# Altium schematic sheet Sheet1.SchDoc: 55
size A3; Date: 2022/5/23; Author: Ashkan Younesi; CompanyName: Electroboard.ir; DrawnBy: Ashkan Younesi; Engineer: Ashkan Younesi; DocumentNumber: 1; Revision: 1; SheetNumber: 1; SheetTotal: 1; Time: Sim808-with-ESP32
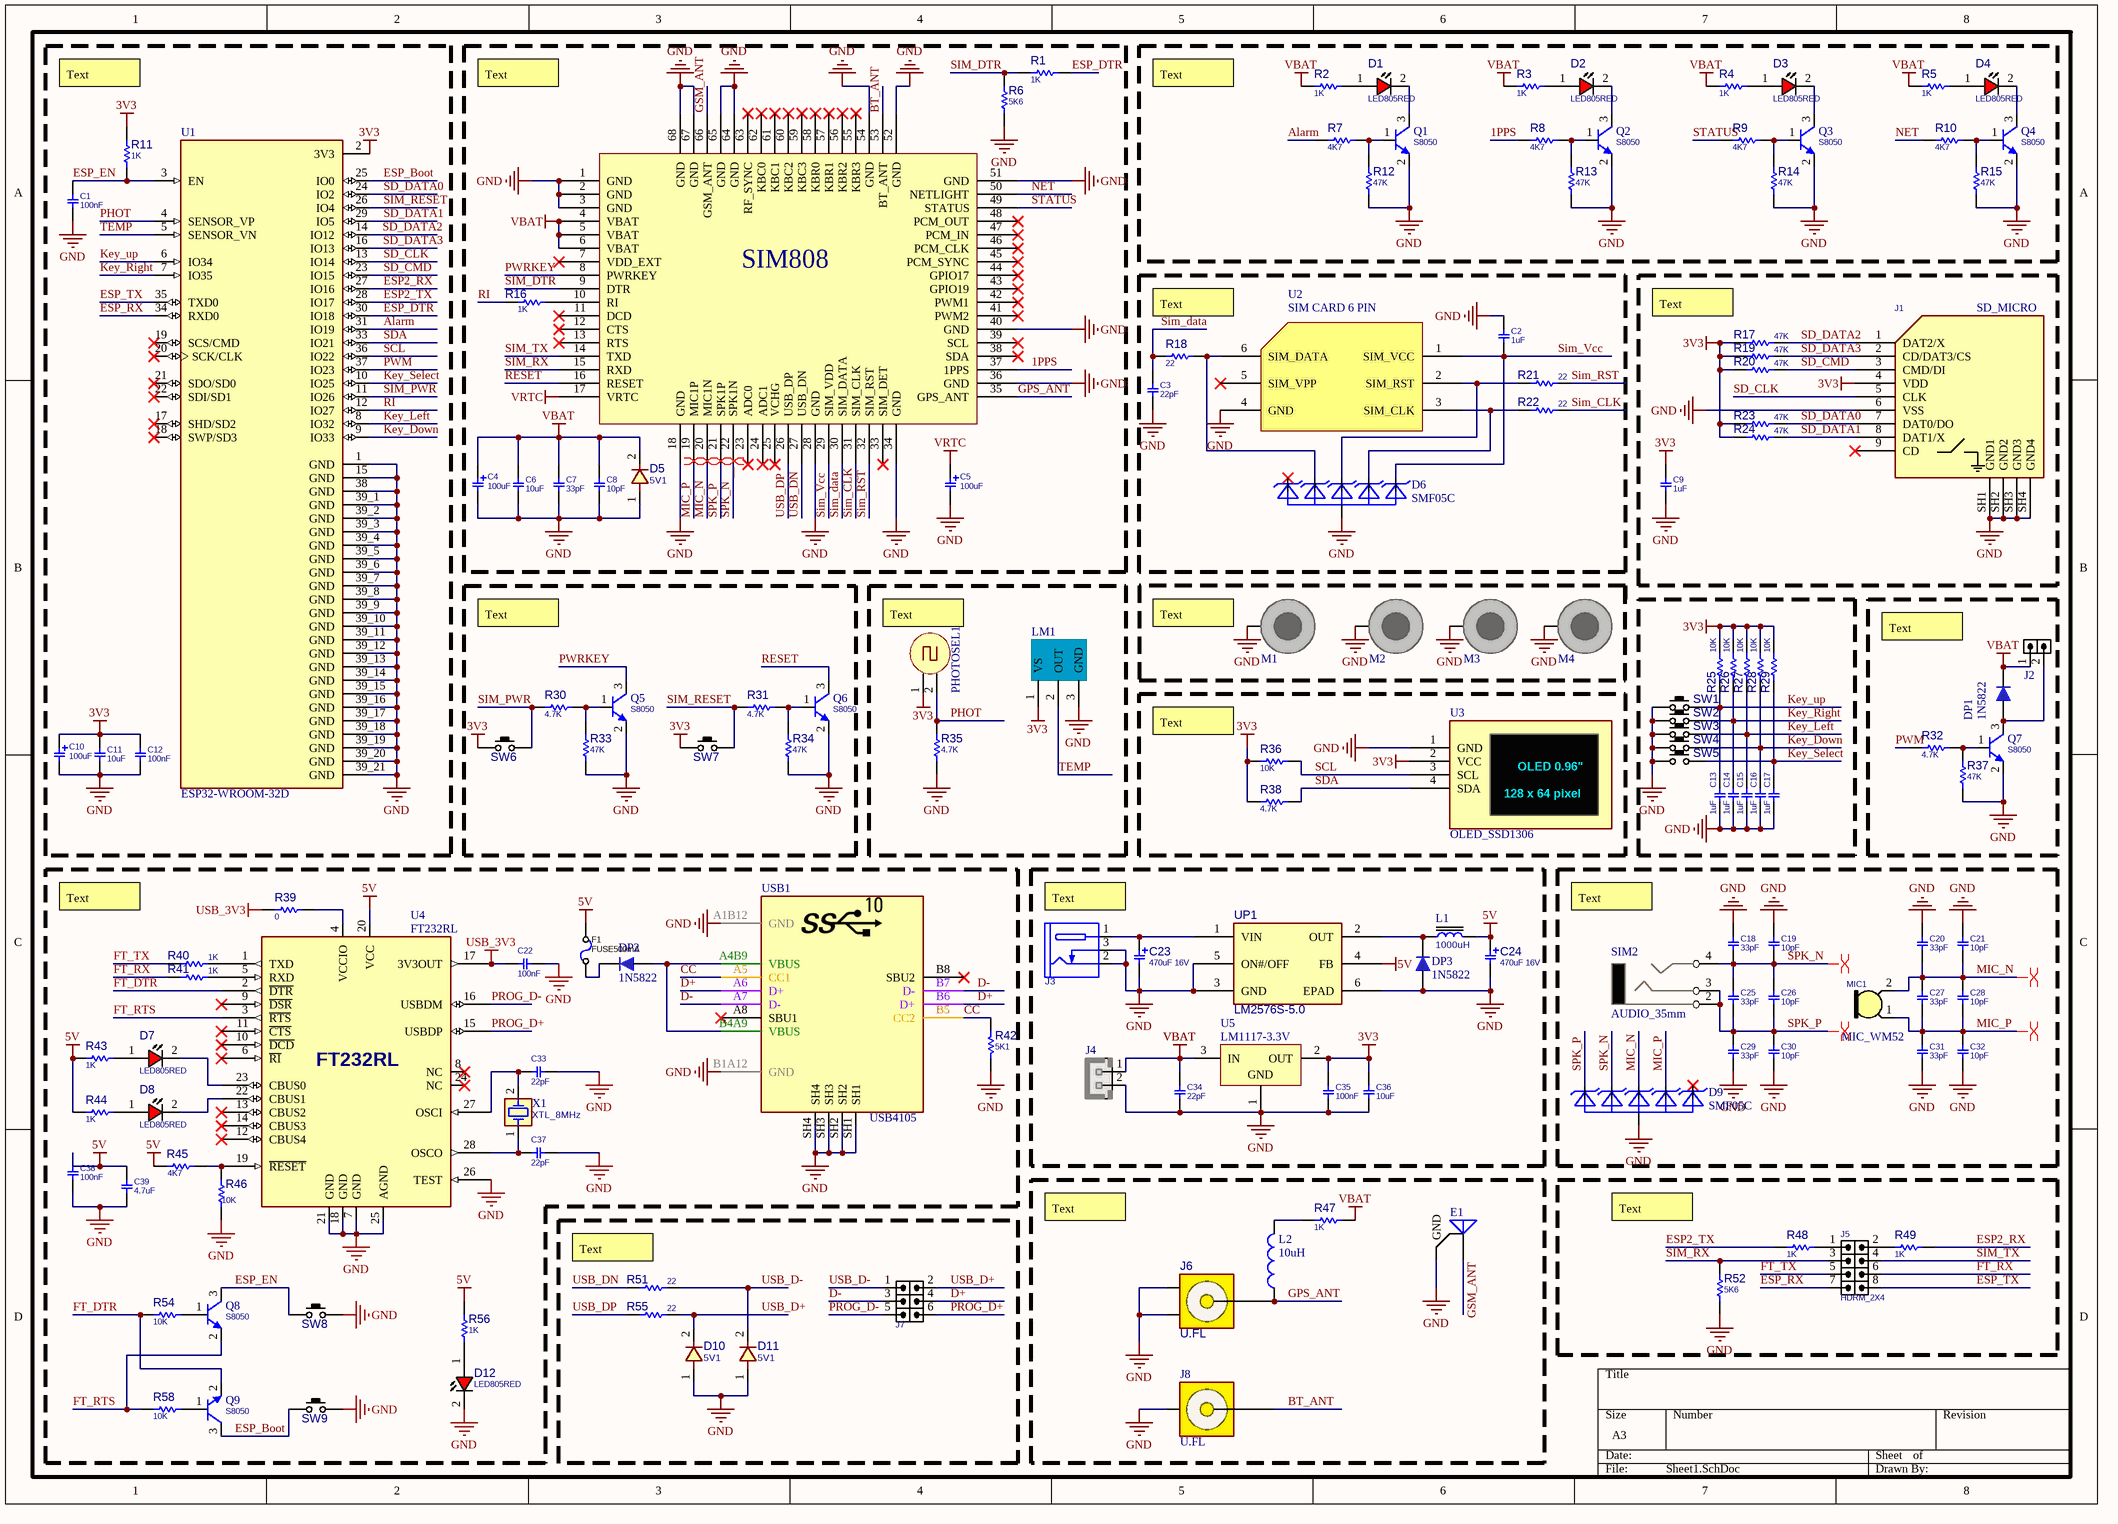
[diagram p0: Sheet1.SchDoc]

## Parts
C1  100nF  [C0805]
C2  1uF  [C0805]
C3  22pF  [C0805]
C4  100uF  [C_TN_3528]
C5  100uF  [C_TN_3528]
C6  10uF  [C0805]
C7  33pF  [C0805]
C8  10pF  [C0805]
C9  1uF  [C0805]
C10  100uF  [C_TN_3528]
C11  10uF  [C0805]
C12  100nF  [C0805]
C13  1uF  [C0805]
C14  1uF  [C0805]
C15  1uF  [C0805]
C16  1uF  [C0805]
C17  1uF  [C0805]
C18  33pF  [C0805]
C19  10pF  [C0805]
C20  33pF  [C0805]
C21  10pF  [C0805]
C22  100nF  [C0805]
C23  470uF 16V  [C_EL_8]
C24  470uF 16V  [C_EL_8]
C25  33pF  [C0805]
C26  10pF  [C0805]
C27  33pF  [C0805]
C28  10pF  [C0805]
C29  33pF  [C0805]
C30  10pF  [C0805]
C31  33pF  [C0805]
C32  10pF  [C0805]
C33  22pF  [C0805]
C34  22pF  [C0805]
C35  100nF  [C0805]
C36  10uF  [C0805]
C37  22pF  [C0805]
C38  100nF  [C0805]
C39  4.7uF  [C0805]
D1  LED805RED  [LED0805RED]
D2  LED805RED  [LED0805RED]
D3  LED805RED  [LED0805RED]
D4  LED805RED  [LED0805RED]
D5  5V1  [D_SOD80]
D6  SMF05C  [SMF05C]
D7  LED805RED  [LED0805RED]
D8  LED805RED  [LED0805RED]
D9  SMF05C  [SMF05C]
D10  5V1  [D_SOD80]
D11  5V1  [D_SOD80]
D12  LED805RED  [LED0805RED]
DP1  1N5822  [430X270D]
DP2  1N5822  [430X270D]
DP3  1N5822  [430X270D]
E1  Antenna  [SMA_Right]  (value not drawn)
F1  FUSE500mA  [F0805]
J1  SD_MICRO  [SDMICRO_AT]
J2  HDRM2  [HDR_M_1X2]  (value not drawn)
J3  DC_POWER_JACK  [JAC_PWR2]  (value not drawn)
J4  HHDR_2  [XH_2]  (value not drawn)
J5  HDRM_2X4  [HDR_M_2X4]
J6  U.FL  [UFL]
J7  HDRM_2X3  [HDR_M_2X3]  (value not drawn)
J8  U.FL  [2.4Ghz]
L1  1000uH  [L_12]
L2  10uH  [IND1206]
LM1  LM35  [TO-92B]  (value not drawn)
M1  DNP/MH  [SCMH_M3]  (value not drawn)  (no BOM)
M2  DNP/MH  [SCMH_M3]  (value not drawn)  (no BOM)
M3  DNP/MH  [SCMH_M3]  (value not drawn)  (no BOM)
M4  DNP/MH  [SCMH_M3]  (value not drawn)  (no BOM)
MIC1  MIC_WM52  [MIC_C9]
PHOTOSEL1  PHOTOSEL  [PHOTOSEL_3mm]  (value not drawn)
Q1  S8050  [SOT23_3]
Q2  S8050  [SOT23_3]
Q3  S8050  [SOT23_3]
Q4  S8050  [SOT23_3]
Q5  S8050  [SOT23_3]
Q6  S8050  [SOT23_3]
Q7  S8050  [SOT23_3]
Q8  S8050  [SOT23_3]
Q9  S8050  [SOT23_3]
R1  1K  [R0805]
R2  1K  [R0805]
R3  1K  [R0805]
R4  1K  [R0805]
R5  1K  [R0805]
R6  5K6  [R0805]
R7  4K7  [R0805]
R8  4K7  [R0805]
R9  4K7  [R0805]
R10  4K7  [R0805]
R11  1K  [R0805]
R12  47K  [R0805]
R13  47K  [R0805]
R14  47K  [R0805]
R15  47K  [R0805]
R16  1K  [R0805]
R17  47K  [R0805]
R18  22  [R0805]
R19  47K  [R0805]
R20  47K  [R0805]
R21  22  [R0805]
R22  22  [R0805]
R23  47K  [R0805]
R24  47K  [R0805]
R25  10K  [R0805]
R26  10K  [R0805]
R27  10K  [R0805]
R28  10K  [R0805]
R29  10K  [R0805]
R30  4.7K  [R0805]
R31  4.7K  [R0805]
R32  4.7K  [R0805]
R33  47K  [R0805]
R34  47K  [R0805]
R35  4.7K  [R0805]
R36  10K  [R0805]
R37  47K  [R0805]
R38  4.7K  [R0805]
R39  0  [R0805]
R40  1K  [R0805]
R41  1K  [R0805]
R42  5K1  [R0805]
R43  1K  [R0805]
R44  1K  [R0805]
R45  4K7  [R0805]
R46  10K  [R0805]
R47  1K  [R0805]
R48  1K  [R0805]
R49  1K  [R0805]
R51  22  [R0805]
R52  5K6  [R0805]
R54  10K  [R0805]
R55  22  [R0805]
R56  1K  [R0805]
R58  10K  [R0805]
SIM1  sim808  [sim808_fp]  (value not drawn)
SIM2  AUDIO_35mm  [AUDIO_JACK2]
SW1  PUSHBUTTON  [SWPBS_SPST_6X3X5]  (value not drawn)
SW2  PUSHBUTTON  [SWPBS_SPST_6X3X5]  (value not drawn)
SW3  PUSHBUTTON  [SWPBS_SPST_6X3X5]  (value not drawn)
SW4  PUSHBUTTON  [SWPBS_SPST_6X3X5]  (value not drawn)
SW5  PUSHBUTTON  [SWPBS_SPST_6X3X5]  (value not drawn)
SW6  PUSHBUTTON  [SWPBS_SPST_6X3X5]  (value not drawn)
SW7  PUSHBUTTON  [SWPBS_SPST_6X3X5]  (value not drawn)
SW8  PUSHBUTTON  [SWPBS_SPST_6X3X5]  (value not drawn)
SW9  PUSHBUTTON  [SWPBS_SPST_6X3X5]  (value not drawn)
U1  ESP32-WROOM-32D  [MODULE_ESP32-WROOM-32D]
U2  SIM CARD 6 PIN  [SIM CARD 6 PIN nano]
U3  OLED_SSD1306  [OLED_SSD1306_64_I2C]
U4  FT232RL  [SOG65_28_W]
U5  LM1117-3.3V  [LM1117_SMD_SOT-223_3.3V]
UP1  LM2576S-5.0  [D2PAK_5]
USB1  USB4105  [USBC_SMD_16_USB4105]
X1  XTL_8MHz  [XTL_2_11X5]

## Nets
3V3: C9.1 C10.1 C11.1 C12.1 C35.2 C36.2 J1.4(VDD) LM1.1(VS) PHOTOSEL1.1 R11.1 R17.2 R19.2 R20.2 R23.2 R24.2 R25.2 R26.2 R27.2 R28.2 R29.2 R36.1 R38.2 SW6.1(P1) SW7.1(P1) U1.2(3V3) U3.2(VCC) U5.2(OUT)
5V: C24.1 C38.2 C39.2 F1.1 L1.2 R43.1 R44.1 R45.2 R56.1 U4.20(VCC) UP1.4(FB)
GND: C1.2 C2.1 C3.1 C4.2 C5.2 C6.1 C7.1 C8.1 C9.2 C10.2 C11.2 C12.2 C13.1 C14.1 C15.1 C16.1 C17.1 C18.2 C19.1 C20.2 C21.2 C22.2 C23.2 C24.2 C29.1 C30.1 C31.1 C32.1 C33.2 C34.1 C35.1 C36.1 C37.2 C38.1 C39.1 D5.1 D6.2(A) D9.2(A) D10.1 D11.1 D12.2(CATHODE) DP3.1 E1.2(GND) J1.6(VSS) J1.SH1(GND1) J1.SH2(GND2) J1.SH3(GND3) J1.SH4(GND4) J3.2(SLEEVE) J3.3(INSERTION_DET) J4.2 J6.2(G1) J6.3(G2) J8.2(G1) LM1.3(GND) M1.1 M2.1 M3.1 M4.1 Q1.2(E) Q2.2(E) Q3.2(E) Q4.2(E) Q5.2(E) Q6.2(E) Q7.2(E) R6.1 R12.1 R13.1 R14.1 R15.1 R33.1 R34.1 R35.1 R37.1 R42.1 R46.1 R52.1 SIM1.1(GND) SIM1.2(GND) SIM1.3(GND) SIM1.18(GND) SIM1.28(GND) SIM1.34(GND) SIM1.36(GND) SIM1.40(GND) SIM1.51(GND) SIM1.52(GND) SIM1.54(GND) SIM1.64(GND) SIM1.65(GND) SIM1.67(GND) SIM1.68(GND) SW1.1(P1) SW2.1(P1) SW3.1(P1) SW4.1(P1) SW5.1(P1) SW8.2(P3) SW9.2(P3) U1.1(GND) U1.15(GND) U1.38(GND) U1.39_1(GND) U1.39_2(GND) U1.39_3(GND) U1.39_4(GND) U1.39_5(GND) U1.39_6(GND) U1.39_7(GND) U1.39_8(GND) U1.39_9(GND) U1.39_10(GND) U1.39_11(GND) U1.39_12(GND) U1.39_13(GND) U1.39_14(GND) U1.39_15(GND) U1.39_16(GND) U1.39_17(GND) U1.39_18(GND) U1.39_19(GND) U1.39_20(GND) U1.39_21(GND) U2.4(GND) U3.1(GND) U4.7(GND) U4.18(GND) U4.21(GND) U4.25(AGND) U4.26(TEST) U5.1(GND) UP1.3(GND) UP1.5(ON#/OFF) UP1.6(EPAD) USB1.A1B12(GND) USB1.B1A12(GND) USB1.SH1 USB1.SH2 USB1.SH3 USB1.SH4
USB_3V3: C22.1 R39.1 U4.17(3V3OUT)
VBAT: C4.1 C6.2 C7.2 C8.2 C34.2 D5.2 DP1.2 J2.1 J4.1 R2.2 R3.2 R4.2 R5.2 R47.1 SIM1.4(VBAT) SIM1.5(VBAT) SIM1.6(VBAT) U5.3(IN)
VRTC: C5.1 SIM1.17(VRTC)
1PPS: R8.1 SIM1.37(1PPS)
~{SIM_RX}: J5.3 R52.2 SIM1.15(RXD)
Alarm: R7.1 U1.31(IO19)
BT_ANT: J8.1(SIG) SIM1.53(BT_ANT)
CC: R42.2 USB1.A5(CC1) USB1.B5(CC2)
D+: J7.4 USB1.A6(D+) USB1.B6(D+)
D-: J7.3 USB1.A7(D-) USB1.B7(D-)
ESP2_RX: R49.1 U1.27(IO16)
ESP2_TX: R48.2 U1.28(IO17)
ESP_Boot: Q9.3(C) SW9.1(P1) U1.25(IO0)
ESP_DTR: R1.1 U1.30(IO18)
ESP_EN: C1.1 Q8.3(C) R11.2 SW8.1(P1) U1.3(EN)
ESP_RX: J5.7 U1.34(RXD0)
ESP_TX: J5.8 U1.35(TXD0)
FT_DTR: Q9.2(E) R54.1 U4.2(~{DTR})
FT_RTS: Q8.2(E) R58.1 U4.3(~{RTS})
FT_RX: J5.6 R41.1
FT_TX: J5.5 R40.1
GPS_ANT: J6.1(SIG) L2.1 SIM1.35(GPS_ANT)
GSM_ANT: E1.1(A) SIM1.66(GSM_ANT)
Key_Down: C16.2 R28.1 SW4.2(P3) U1.9(IO33)
Key_Left: C15.2 R27.1 SW3.2(P3) U1.8(IO32)
Key_Right: C14.2 R26.1 SW2.2(P3) U1.7(IO35)
Key_Select: C17.2 R29.1 SW5.2(P3) U1.10(IO25)
Key_up: C13.2 R25.1 SW1.2(P3) U1.6(IO34)
MIC_N: C20.1 C21.1 C27.2 C28.2 D9.4(C3) MIC1.2(GND) SIM1.20(MIC1N)
MIC_P: C27.1 C28.1 C31.2 C32.2 D9.5(C4) MIC1.1(OUT) SIM1.19(MIC1P)
NET: R10.1 SIM1.50(NETLIGHT)
PHOT: PHOTOSEL1.2 R35.2 U1.4(SENSOR_VP)
PROG_D+: J7.6 U4.15(USBDP)
PROG_D-: J7.5 U4.16(USBDM)
PWM: R32.1 U1.37(IO23)
PWRKEY: Q5.3(C) SIM1.8(PWRKEY)
RESET: Q6.3(C) SIM1.16(RESET)
RI: R16.2 U1.12(IO27)
SCL: R36.2 U1.36(IO22) U3.3(SCL)
SD_CLK: J1.5(CLK) U1.13(IO14)
SD_CMD: J1.3(CMD/DI) R20.1 U1.23(IO15)
SD_DATA0: J1.7(DAT0/DO) R23.1 U1.24(IO2)
SD_DATA1: J1.8(DAT1/X) R24.1 U1.29(IO5)
SD_DATA2: J1.1(DAT2/X) R17.1 U1.14(IO12)
SD_DATA3: J1.2(CD/DAT3/CS) R19.1 U1.16(IO13)
SDA: R38.1 U1.33(IO21) U3.4(SDA)
Sim_CLK: R22.1 SIM1.31(SIM_CLK)
Sim_data: C3.2 R18.2 SIM1.30(SIM_DATA)
SIM_DTR: R1.2 R6.2 SIM1.9(DTR)
SIM_PWR: R30.1 SW6.2(P3) U1.11(IO26)
SIM_RESET: R31.1 SW7.2(P3) U1.26(IO4)
Sim_RST: R21.1 SIM1.32(SIM_RST)
SIM_TX: J5.4 SIM1.14(TXD)
Sim_Vcc: C2.2 D6.6(C5) SIM1.29(SIM_VDD) U2.1(SIM_VCC)
SPK_N: C18.1 C19.2 C25.2 C26.2 D9.3(C2) SIM1.22(SPK1N) SIM2.4
SPK_P: C25.1 C26.1 C29.2 C30.2 D9.1(C1) SIM1.21(SPK1P) SIM2.2 SIM2.3
STATUS: R9.1 SIM1.49(STATUS)
TEMP: LM1.2(OUT) U1.5(SENSOR_VN)
USB_D+: D10.2 J7.2 R55.1
USB_D-: D11.2 J7.1 R51.1
USB_DN: R51.2 SIM1.27(USB_DN)
USB_DP: R55.2 SIM1.26(USB_DP)
NetC23_1: C23.1 J3.1(TIP) UP1.1(VIN)
NetC33_1: C33.1 U4.27(OSCI) X1.2(OSC2)
NetC37_1: C37.1 U4.28(OSCO) X1.1(OSC1)
NetD1_1: D1.1(ANODE) R2.1
NetD1_2: D1.2(CATHODE) Q1.3(C)
NetD2_1: D2.1(ANODE) R3.1
NetD2_2: D2.2(CATHODE) Q2.3(C)
NetD3_1: D3.1(ANODE) R4.1
NetD3_2: D3.2(CATHODE) Q3.3(C)
NetD4_1: D4.1(ANODE) R5.1
NetD4_2: D4.2(CATHODE) Q4.3(C)
NetD6_3: D6.3(C2) R18.1 U2.6(SIM_DATA)
NetD6_4: D6.4(C3) R21.2 U2.2(SIM_RST)
NetD6_5: D6.5(C4) R22.2 U2.3(SIM_CLK)
NetD7_1: D7.1(ANODE) R43.2
NetD7_2: D7.2(CATHODE) U4.23(CBUS0)
NetD8_1: D8.1(ANODE) R44.2
NetD8_2: D8.2(CATHODE) U4.22(CBUS1)
NetD12_1: D12.1(ANODE) R56.2
NetDP1_1: DP1.1 J2.2 Q7.3(C)
NetDP2_1: DP2.1 USB1.A4B9(VBUS) USB1.B4A9(VBUS)
NetDP2_2: DP2.2 F1.2
NetDP3_2: DP3.2 L1.1 UP1.2(OUT)
NetJ5_1: J5.1 R48.1
NetJ5_2: J5.2 R49.2
NetL2_2: L2.2 R47.2
NetQ1_1: Q1.1(B) R7.2 R12.2
NetQ2_1: Q2.1(B) R8.2 R13.2
NetQ3_1: Q3.1(B) R9.2 R14.2
NetQ4_1: Q4.1(B) R10.2 R15.2
NetQ5_1: Q5.1(B) R30.2 R33.2
NetQ6_1: Q6.1(B) R31.2 R34.2
NetQ7_1: Q7.1(B) R32.2 R37.2
NetQ8_1: Q8.1(B) R54.2
NetQ9_1: Q9.1(B) R58.2
NetR16_1: R16.1 SIM1.10(RI)
NetR39_2: R39.2 U4.4(VCCIO)
NetR40_2: R40.2 U4.1(TXD)
NetR41_2: R41.2 U4.5(RXD)
NetR45_1: R45.1 R46.2 U4.19(~{RESET})

Not connected (* = marked no-connect by the designer): D6 1(C1)*; D9 6(C5)*; J1 9(CD)*; SIM1 7(VDD_EXT)* 11(DCD)* 12(CTS)* 13(RTS)* 23(ADC0)* 24(ADC1)* 25(VCHG)* 33(SIM_DET)* 38(SDA)* 39(SCL)* 41(PWM2)* 42(PWM1)* 43(GPIO19)* 44(GPIO17)* 45(PCM_SYNC)* 46(PCM_CLK)* 47(PCM_IN)* 48(PCM_OUT)* 55(KBR3)* 56(KBR2)* 57(KBR1)* 58(KBR0)* 59(KBC3)* 60(KBC2)* 61(KBC1)* 62(KBC0)* 63(RF_SYNC)*; U1 17(SHD/SD2)* 18(SWP/SD3)* 19(SCS/CMD)* 20(SCK/CLK)* 21(SDO/SD0)* 22(SDI/SD1)*; U2 5(SIM_VPP)*; U4 6(~{RI})* 8(NC)* 9(~{DSR})* 10(~{DCD})* 11(~{CTS})* 12(CBUS4)* 13(CBUS2)* 14(CBUS3)* 24(NC)*; USB1 A8(SBU1)* B8(SBU2)*

## Layout directives
differential pair: (no net found under the mark), MIC_N, MIC_P, SPK_N, SPK_P

## Notes on the sheet
- Text
- (near PHOTOSEL1) Text
- (near M1) Text
- (near R36) Text
- (near R51) Text
- (in symbol OLED_SSD1306_64_I2C) OLED 0.96"; 128 x 64 pixel
- (in symbol sim808) SIM808

## Library data of the parts
C1-C3 C6-C9 C11-C21 C25-C32 C34-C36 = CAP_SMD_MLCC_0805: CAP, MLCC, -F, -V, MATERIAL, -%, 0201; PARAM: -, -%; MANF_P#: MANF_PART#; PRICE: 100= 1$; MANF: -; PARAM2: -V; ASSEMBLY: ASSEMBLY
  C1 C12 C35: VALUE: 100nF
  C2 C9 C13-C17: VALUE: 1uF
  C3 C34: VALUE: 22pF
  C6 C11 C36: VALUE: 10uF
  C7 C18 C20 C25 C27 C29 C31: VALUE: 33pF
  C8 C19 C21 C26 C28 C30 C32: VALUE: 10pF
C4 C5 C10 = CAP_SMD_TAN_10uF_16V: CAP, SMD, TAN; PARAM: 20%, 200mOhm, -55~105oC; MANF: AVX; MANF_P#: TCJT106M016R0200; PARAM2: 16V; PRICE: 1$; VALUE: 100uF
C22 C33 C37-C39 = CAP_SMD_MLCC: CAP, MLCC, 1nF, 50V, C0G, 10%, 0402; MANF_P#: MANF_PART#; MANF: Murata; PARAM: C0G, 10%; PRICE: 100= 1$; DESC: CAP, MLCC, 1nF, 50V, C0G, 10%, 0402; PARAM2: 50V; ASSEMBLY: ASSEMBLY
  C22 C38: VALUE: 100nF
  C33 C37: VALUE: 22pF
  C39: VALUE: 4.7uF
C23 C24 = CAP_SMD_EL_330u25V: CAP, SMDD, ELEC, 330uF, 25V; MANF_P#: EEE-1EA331UP; PARAM2: 20%; MANF: PANASONIC; DESC: DESCRIPTION; DIST#: MOUSER; PRICE: 10= 5$; ASSEMBLY: ASSEMBLY; PARAM: 25V; VALUE: 470uF 16V
D1-D4 D7 D8 D12 = LED_SMD_0805_RED: LED, SMD, 0805, RED; DESC: DESCRIPTION; MANF_P#: MANF_PART#; PARAM2: 2.2V; MANF: MANF; ASSEMBLY: ASSEMBLY; PRICE: 36t@Javan; VALUE: LED805RED
D5 D10 D11 = DIODE_SMD_1N4148_SOD80: DIODE, FAST SWTICHING, 0.3A, 0.5W; DESC: DESCRIPTION; PARAM: 75V; PARAM2: 300mA, 0.5W; MANF_P#: 1N4148; MANF: MANF; ASSEMBLY: ASSEMBLY; PRICE: PRICE; VALUE: 5V1
D6 D9 = SMF05C: 12.5V Clamp 8A _8/20Âµs_ Ipp Tvs Diode Surface Mount SC-88/SC70-6/SOT-363; MF: ON Semiconductor; Availability: Unavailable; Price: None; Package: SOT-363 ON Semiconductor; Value: *; SnapEDA_Link: https://www.snapeda.com/parts/SMF05C/ON%20Semiconductor/view-part/2782704/?ref=snap; MP: SMF05C
DP1-DP3 = 1N5819: Schottkey Rectifiers; Designer: Abbas Basereh; Data: 16-12-2016; Link: *; Part. No: *
E1 = Antenna: Generic Antenna; Published: 24-Mar-1999; LatestRevisionDate: 17-Jul-2002; LatestRevisionNote: Re-released for DXP Platform.; PackageReference: PIN1; Publisher: Altium Limited
F1 = FUSE_500mA_0805_FAST: Fuse, 500mA, 32VDC, 0805, SMD, Fast Acting; PARAM: 500mA; 32VDC; fast acting; MANF_P#: MANF_PART#; PARAM2: 0.25 Ohm DC Cold Resistance; MANF: MANF; VALUE: FUSE500mA
J1 = SOCKET_SDMICRO_AT: SD MICRO exist in Iran, Attend 112J-TDAR-R01; PARAM: push-push; MANF: Attend; MANF_P#: 112J-TDAR-R01; VALUE: SD_MICRO
J2 = HDR_M_1X2: CONN, HEADER, Male, pitch: 2.54mm, 2POS; VALUE: HDRM2
J3 = CONN_PWR_JACKR2: CONN, PWR JACK DC, PLUG DIAM 2.0MM RA THD; MANF: CUI STACK; MANF_P#: PJ-202A, PJ-002AH, PJ-102AH, KLDX-0202; VALUE: DC_POWER_JACK
J4 = XH_2: JST-XH pitch: 2.5mm; VALUE: HHDR_2
J5 = HDR_M_2X4: CONN, HEADER, Male, pitch: 2.54mm, 8POS; MANF_P#: MANF_PART#; MANF: MANF; VALUE: HDRM_2X4
J6 = CONN_RF_UFL: CONN, RF, U.FL, STRAIGHT, Ultra Miniature Coaxial; MANF_P#: CONUFL001-SMD, U.FL-R-SMT-1(10), 128-0711-201; MANF: Linx, Hirose, Cinch; PARAM: 50Ohm, 6GHz; DESC: DESCRIPTION; DIST#: DIGIKEY, MOUSER; PARAM2: GOLD; ASSEMBLY: ASSEMBLY; PRICE: 0.9$; VALUE: U.FL
J7 = HDR_M_2X3: CONN, HEADER, Male, pitch: 2.54mm, 6POS; MANF_P#: MANF_PART#; MANF: MANF; VALUE: HDRM_2X3
J8 = BT & Wifi Anntena
L1 = INDPWR_SMD: INDUCTOR, POWER, SMD; VALUE: 1000uH
L2 = INDUCTOR SMD PACKAGE: TOTAL INDUCTOR SMD PACK; Designer: Abbas Basereh; Desc.: INDUCTOR  SMD TOTAL PACKAGES; VALUE: 1u; Data: 2017-3-10
M1-M4 = SCMH_M3: SCREW mouting, M3, 3.0mm diameter and 6.0mm PanHead; ASSEMBLY: DNP; VALUE: DNP/MH
MIC1 = MIC_WM-52: MICROPHONE OMNI; MANF_P#: WM52BM; PRICE: PRICE; Value: MIC_WM52
Q1-Q9 = NPN_S8050_SOT23: BJT, NPN, 25v, 0.5A, SMD, SOT23; PARAM2: 300mW; PARAM: 25v, 0.5A; MANF_P#: S8050; MANF: -; VALUE: S8050
R1-R49 R51 R52 R54-R56 R58 = RES_SMD_0805: RESISTOR, SMD; PARAM: -W; DESC: DESCRIPTION; DIST#: MOUSER; PARAM2: 1%; MANF_P#: -; MANF: -; ASSEMBLY: ASSEMBLY; PRICE: 100= 0.5$
  R1-R5 R11 R16 R40 R41 R43 R44 R47-R49 R56: VALUE: 1K
  R6 R52: VALUE: 5K6
  R7-R10 R45: VALUE: 4K7
  R12-R15 R17 R19 R20 R23 R24 R33 R34 R37: VALUE: 47K
  R18 R21 R22 R51 R55: VALUE: 22
  R25-R29 R36 R46 R54 R58: VALUE: 10K
  R30-R32 R35 R38: VALUE: 4.7K
  R39: VALUE: 0
  R42: VALUE: 5K1
SIM2 = AUDIO_NEW
SW1-SW9 = SWPBS_SPST_6X3X5: SWITCH, PUSH BUTTON, TACTILE, SMD, SPST, 6X3.5X5mm; MANF: ALPS; DESC: DESCRIPTION; MANF_P#: SKQMBBE010; VALUE: PUSHBUTTON; ASSEMBLY: ASSEMBLY; PARAM: PARAM; PRICE: PRICE
U1 = ESP32-WROOM-32D: Bluetooth, WiFi 802.11b/g/n, Bluetooth v4.2 + EDR, Class 1, 2 and 3 Transceiver Module 2.4GHz ~ 2.5GHz Integrated, Trace Surface Mount; MF: Espressif Systems; Price: None; Package: Module Espressif Systems; Availability: Unavailable; SnapEDA_Link: https://www.snapeda.com/parts/ESP32-WROOM-32D/Espressif%20Systems/view-part/2768115/?ref=snap; Value: *; MP: ESP32-WROOM-32D
U2 = SIMCARD 6 PIN: Publisher: Bastam Beyrami
U3 = OLED_SSD1306_64_I2C: OLED, SSD1306, 0.96", 128X64, BREAKOUT I2C; MANF_P#: OLED_SSD1306_I2C; PARAM2: 3.3/5VCC, -20~70oC; PARAM: 2 Colors, 0.96", 128X64; MANF: -; VALUE: OLED_SSD1306
U4 = FT232RL_SSOP28: USB-UART, Asynchronous Serial Data Transfer Chip, SSOP-28; MANF: FTDI; PARAM2: 3.3~5.25Vcc, 1.8~5.25VIO; MANF_P#: FT232RL; VALUE: FT232RL
U5 = LM1117_SMD_SOT-223
UP1 = VREG_LM2576S-5.0: REG, Switching, Buck, 3A, 5V, 50KHz, TO-220; MANF: TI, ON, HTC, MICROCHIP; PARAM: 3A, 5V; DESC: REG, Switching, Buck, 3A, ADJ, 50KHz, TO-220; PARAM2: 50KHz, 40VIN; ASSEMBLY: ASSEMBLY; PRICE: PRICE; MANF_P#: LM2576S-5.0; VALUE: LM2576S-5.0
USB1 = CONN_USBC_SMD_16_USB4105: CONN, USB, Type C, USB 2.0, Right-Angle, SMD; MANF: GCT; MANF_P#: USB4105-GF-A; PARAM: 5A; Price: 1.5$; Value: USB4105
X1 = XTL_2_HC49_8MHz_SMD: Crystal MOST POPULAR ABL HC49 PACKAGE; MANF: ABRACON; MANF_P#: ABLS-8.000MHZ-B4-T; PARAM: 8MHz, 18pF, 30PPM, -20~70oC; PRICE: 0.3$; VALUE: XTL_8MHz